# Altium project SensorNode.PrjPcb
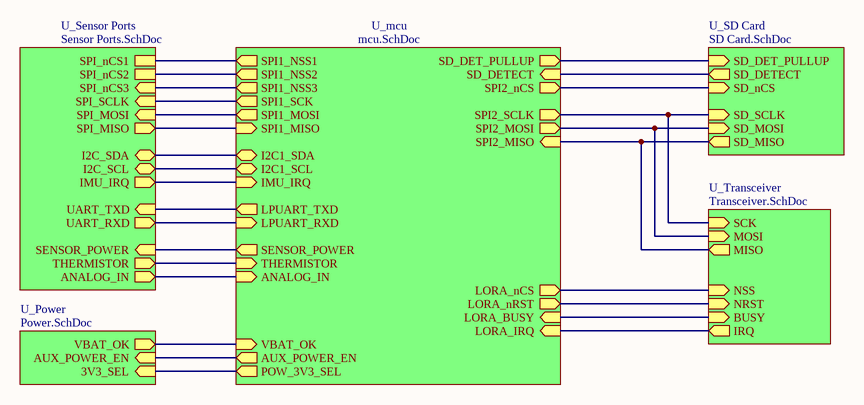
[diagram p0: SensorNode.SchDoc]
6 sheets, 83 parts. Net scope: hierarchical (ports join the sheet entries above them; power ports are global).
Board file: SensorNode.PcbDoc
Sheets:
  SensorNode.SchDoc
    U_mcu = mcu.SchDoc
    U_Sensor Ports = Sensor Ports.SchDoc
    U_SD Card = SD Card.SchDoc
    U_Transceiver = Transceiver.SchDoc
    U_Power = Power.SchDoc

## Sheet SensorNode.SchDoc
size A4

### Sub-sheets
U_mcu = mcu.SchDoc: SPI1_SCK (out), SPI1_MISO (in), SPI1_MOSI (out), I2C1_SDA (bidir), SPI2_MOSI (out), SPI2_MISO (in), SPI2_SCLK (out), SPI2_nCS (out), SD_DET_PULLUP (out), SD_DETECT (in), LORA_nCS (out), LORA_nRST (out), LORA_BUSY (in), LORA_IRQ (in), I2C1_SCL (bidir), AUX_POWER_EN (out), VBAT_OK (in), POW_3V3_SEL (out), LPUART_TXD (out), LPUART_RXD (in), SPI1_NSS1 (out), SPI1_NSS2 (out), SPI1_NSS3 (out), ANALOG_IN (in), THERMISTOR (in), SENSOR_POWER (out), IMU_IRQ (in)
U_Power = Power.SchDoc: VBAT_OK (out), AUX_POWER_EN (in), 3V3_SEL (in)
U_SD Card = SD Card.SchDoc: SD_nCS (in), SD_MOSI (in), SD_SCLK (in), SD_MISO (out), SD_DET_PULLUP (in), SD_DETECT (out)
U_Sensor Ports = Sensor Ports.SchDoc: I2C_SDA (bidir), I2C_SCL (bidir), UART_TXD (in), UART_RXD (out), SPI_MOSI (in), SPI_SCLK (in), SPI_MISO (out), SPI_nCS3 (in), SPI_nCS1, SPI_nCS2, SENSOR_POWER (in), ANALOG_IN (out), THERMISTOR (out), IMU_IRQ (out)
U_Transceiver = Transceiver.SchDoc: SCK (in), NRST (in), BUSY (in), MOSI (in), NSS (in), MISO (out), IRQ (out)

### Nets
I2C_SCL: sheet U_mcu/I2C1_SCL, sheet U_Sensor Ports/I2C_SCL
I2C_SDA: sheet U_mcu/I2C1_SDA, sheet U_Sensor Ports/I2C_SDA
LORA_BUSY: sheet U_mcu/LORA_BUSY, sheet U_Transceiver/BUSY
LORA_IRQ: sheet U_mcu/LORA_IRQ, sheet U_Transceiver/IRQ
LORA_nCS: sheet U_mcu/LORA_nCS, sheet U_Transceiver/NSS
LORA_nRST: sheet U_mcu/LORA_nRST, sheet U_Transceiver/NRST
SD_nCS: sheet U_mcu/SPI2_nCS, sheet U_SD Card/SD_nCS
SPI2_MISO: sheet U_mcu/SPI2_MISO, sheet U_SD Card/SD_MISO, sheet U_Transceiver/MISO
SPI2_MOSI: sheet U_mcu/SPI2_MOSI, sheet U_SD Card/SD_MOSI, sheet U_Transceiver/MOSI
SPI2_SCLK: sheet U_mcu/SPI2_SCLK, sheet U_SD Card/SD_SCLK, sheet U_Transceiver/SCK
NetCD1_10: sheet U_mcu/SD_DETECT, sheet U_SD Card/SD_DETECT
NetP1_1: sheet U_mcu/ANALOG_IN, sheet U_Sensor Ports/ANALOG_IN
NetP8_2: sheet U_mcu/LPUART_TXD, sheet U_Sensor Ports/UART_TXD
NetP8_3: sheet U_mcu/LPUART_RXD, sheet U_Sensor Ports/UART_RXD
NetP9_1: sheet U_mcu/SPI1_NSS1, sheet U_Sensor Ports/SPI_nCS1
NetP9_2: sheet U_mcu/SPI1_NSS2, sheet U_Sensor Ports/SPI_nCS2
NetP9_3: sheet U_mcu/SPI1_NSS3, sheet U_Sensor Ports/SPI_nCS3
NetP9_4: sheet U_mcu/SPI1_SCK, sheet U_Sensor Ports/SPI_SCLK
NetP9_5: sheet U_mcu/SPI1_MOSI, sheet U_Sensor Ports/SPI_MOSI
NetP9_6: sheet U_mcu/SPI1_MISO, sheet U_Sensor Ports/SPI_MISO
NetR6_2: sheet U_mcu/POW_3V3_SEL, sheet U_Power/3V3_SEL
NetR17_1: sheet U_mcu/SD_DET_PULLUP, sheet U_SD Card/SD_DET_PULLUP
NetR20_2: sheet U_mcu/SENSOR_POWER, sheet U_Sensor Ports/SENSOR_POWER
NetR21_1: sheet U_mcu/THERMISTOR, sheet U_Sensor Ports/THERMISTOR
NetU1_39: sheet U_mcu/AUX_POWER_EN, sheet U_Power/AUX_POWER_EN
NetU1_40: sheet U_mcu/VBAT_OK, sheet U_Power/VBAT_OK
NetU1_46: sheet U_mcu/IMU_IRQ, sheet U_Sensor Ports/IMU_IRQ

## Sheet mcu.SchDoc
size A4
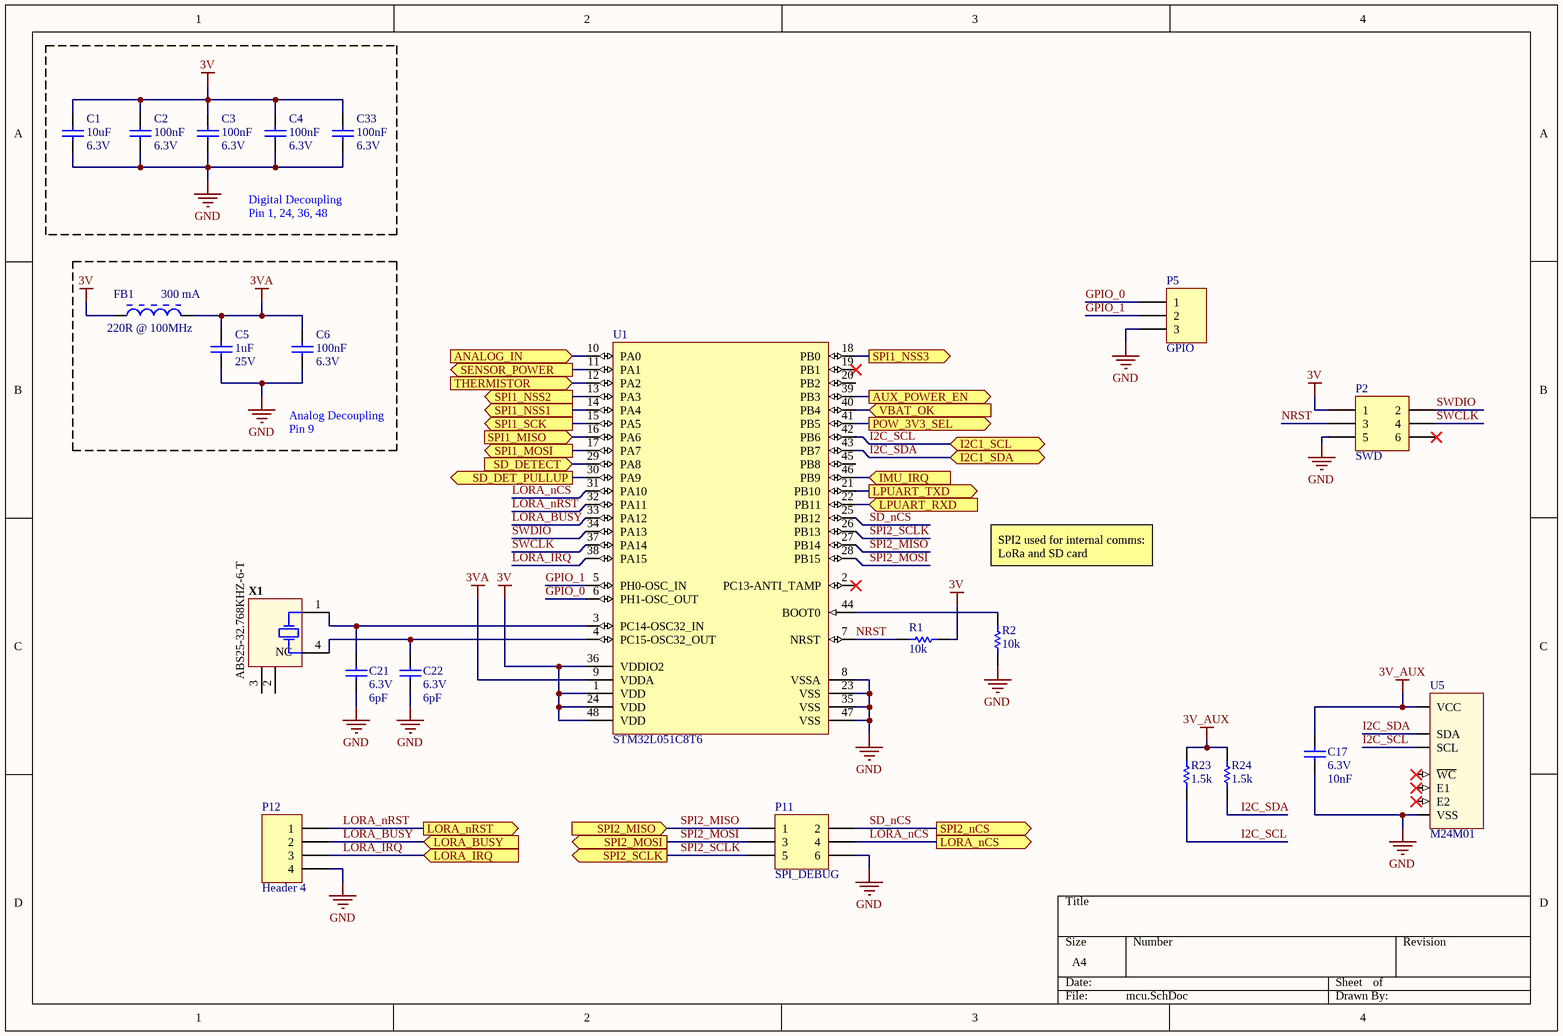
[diagram p1: mcu.SchDoc]

### Parts
C1  value 10uF  Voltage: 6.3V  [0603 (1608M)]  (hidden comment: Cap)
C2  value 100nF  Voltage: 6.3V  [0603 (1608M)]  (hidden comment: Cap)
C3  value 100nF  Voltage: 6.3V  [0603 (1608M)]  (hidden comment: Cap)
C4  value 100nF  Voltage: 6.3V  [0603 (1608M)]  (hidden comment: Cap)
C5  value 1uF  Voltage: 25V  [0603 (1608M)]  (hidden comment: Cap)
C6  value 100nF  Voltage: 6.3V  [0603 (1608M)]  (hidden comment: Cap)
C17  value 10nF  Voltage: 6.3V  [0603 (1608M)]  (hidden comment: Cap)
C21  value 6pF  Voltage: 6.3V  [0603 (1608M)]  (hidden comment: Cap)
C22  value 6pF  Voltage: 6.3V  [0603 (1608M)]  (hidden comment: Cap)
C33  value 100nF  Voltage: 6.3V  [0603 (1608M)]  (hidden comment: Cap)
FB1  Rated Current: 300 mA  Parameter 1: 220R @ 100MHz  [MURA-BLM15-CHIP-2_V]  (hidden comment: BLM15GG221SN1D)
P2  SWD  [HDR2X3]
P5  GPIO  [HDR1X3]
P11  SPI_DEBUG  [HDR2X3]
P12  Header 4  [HDR1X4]
R1  value 10k  [0603 (1608M)]  (hidden comment: Resistor)
R2  value 10k  [0603 (1608M)]  (hidden comment: Resistor)
R23  value 1.5k  [0603 (1608M)]  (hidden comment: Resistor)
R24  value 1.5k  [0603 (1608M)]  (hidden comment: Resistor)
U1  STM32L051C8T6  [STM-LQFP48_L]
U5  M24M01  [TSSOP-8]
X1  ABS25-32.768KHZ-6-T  [ABRA-ABS25-4_V]

### Ports
ANALOG_IN (in), AUX_POWER_EN (out), I2C1_SCL (bidir), I2C1_SDA (bidir), IMU_IRQ (in), LORA_BUSY (in), LORA_IRQ (in), LORA_nCS (out), LORA_nRST (out), LPUART_RXD (in), LPUART_TXD (out), POW_3V3_SEL (out), SD_DET_PULLUP (out), SD_DETECT (in), SENSOR_POWER (out), SPI1_MISO (in), SPI1_MOSI (out), SPI1_NSS1 (out), SPI1_NSS2 (out), SPI1_NSS3 (out), SPI1_SCK (out), SPI2_MISO (in), SPI2_MOSI (out), SPI2_nCS (out), SPI2_SCLK (out), THERMISTOR (in), VBAT_OK (in)

### Nets
3V: C1.2 C2.2 C3.2 C4.2 C33.2 FB1.2 P2.1 R1.1 U1.1(VDD) U1.24(VDD) U1.36(VDDIO2) U1.48(VDD)
3V_AUX: C17.2 R23.2 R24.2 U5.8(VCC)
3VA: C5.2 C6.2 FB1.1 U1.9(VDDA)
GND: C1.1 C2.1 C3.1 C4.1 C5.1 C6.1 C17.1 C21.1 C22.1 C33.1 P2.5 P5.3 P11.6 P12.4 R2.1 U1.8(VSSA) U1.23(VSS) U1.35(VSS) U1.47(VSS) U5.4(VSS)
GPIO_0: P5.1 U1.6(PH1-OSC_OUT)
GPIO_1: P5.2 U1.5(PH0-OSC_IN)
I2C_SCL: R23.1 U1.42(PB6) U5.6(SCL) ; port I2C1_SCL
I2C_SDA: R24.1 U1.43(PB7) U5.5(SDA) ; port I2C1_SDA
LORA_BUSY: P12.2 U1.33(PA12) ; port LORA_BUSY
LORA_IRQ: P12.3 U1.38(PA15) ; port LORA_IRQ
LORA_nCS: P11.4 U1.31(PA10) ; port LORA_nCS
LORA_nRST: P12.1 U1.32(PA11) ; port LORA_nRST
NRST: P2.3 R1.2 U1.7(NRST)
SD_nCS: P11.2 U1.25(PB12) ; port SPI2_nCS
SPI2_MISO: P11.1 U1.27(PB14) ; port SPI2_MISO
SPI2_MOSI: P11.3 U1.28(PB15) ; port SPI2_MOSI
SPI2_SCLK: P11.5 U1.26(PB13) ; port SPI2_SCLK
SWCLK: P2.4 U1.37(PA14)
SWDIO: P2.2 U1.34(PA13)
NetC21_2: C21.2 U1.3(PC14-OSC32_IN) X1.1(X1)
NetC22_2: C22.2 U1.4(PC15-OSC32_OUT) X1.4(X2)
NetCD1_10: U1.29(PA8) ; port SD_DETECT
NetP1_1: U1.10(PA0) ; port ANALOG_IN
NetP8_2: U1.21(PB10) ; port LPUART_TXD
NetP8_3: U1.22(PB11) ; port LPUART_RXD
NetP9_1: U1.14(PA4) ; port SPI1_NSS1
NetP9_2: U1.13(PA3) ; port SPI1_NSS2
NetP9_3: U1.18(PB0) ; port SPI1_NSS3
NetP9_4: U1.15(PA5) ; port SPI1_SCK
NetP9_5: U1.17(PA7) ; port SPI1_MOSI
NetP9_6: U1.16(PA6) ; port SPI1_MISO
NetR2_2: R2.2 U1.44(BOOT0)
NetR6_2: U1.41(PB5) ; port POW_3V3_SEL
NetR17_1: U1.30(PA9) ; port SD_DET_PULLUP
NetR20_2: U1.11(PA1) ; port SENSOR_POWER
NetR21_1: U1.12(PA2) ; port THERMISTOR
NetU1_39: U1.39(PB3) ; port AUX_POWER_EN
NetU1_40: U1.40(PB4) ; port VBAT_OK
NetU1_46: U1.46(PB9) ; port IMU_IRQ

Not connected (* = marked no-connect by the designer): P2 6*; U1 2(PC13-ANTI_TAMP)* 19(PB1)* 20(PB2) 45(PB8); U5 2(E1)* 3(E2)* 7(~{WC})*; X1 2(NC) 3(NC)

### Notes on the sheet
- Digital Decoupling
- Pin 1, 24, 36, 48
- Analog Decoupling
- Pin 9
- SPI2 used for internal comms:
  LoRa and SD card

### Library data of the parts
C1-C6 C17 C21 C22 C33 = Cap: Capacitor
FB1 = CMP-0686-00164-3: Chip Ferrite Bead for High-GHz Band General Use, 220 Ohm, 300 mA, -55 to 125 degC, 1 x 0.5 x 0.55 mm SMD, Tape and Reel; Manufacturer: Murata; DC Resistance: 0.7 Ohm Max.; Impedance (at 100 MHz): 220 Ohm +/- 25%; PackageDescription: 2-Pin Chip, Body 1 x 0.5 mm; PartNumber: BLM15GG221SN1D; PackageReference: BLM15-2; ComponentLink3URL: http://www.murata.com/products/catalog/pdf/c31e.pdf; ComponentLink2URL: http://www.murata.com/products/catalog/pdf/c31e.pdf; ComponentLink2Description: Datasheet; Operating Temperature Range: -55 to 125 degC; ComponentLink1Description: Manufacturer URL; ComponentLink3Description: Package Specification; DatasheetVersion: 08/2013; ComponentLink1URL: http://www.murata.com/; Mounting Technology: Surface Mount; Packing: Tape and Reel
P2 P11 = Header 3X2: Header, 3-Pin, Dual row; LatestRevisionDate: 17-Jul-2002; LatestRevisionNote: Re-released for DXP Platform.; Publisher: Altium Limited
P5 = Header 3: Header, 3-Pin; LatestRevisionDate: 17-Jul-2002; LatestRevisionNote: Re-released for DXP Platform.; Publisher: Altium Limited
P12 = Header 4: Header, 4-Pin; LatestRevisionDate: 17-Jul-2002; LatestRevisionNote: Re-released for DXP Platform.; Publisher: Altium Limited
R1 R2 R23 R24 = Resistor: Tolerance: 5%; Published: 8-Jun-2000; LatestRevisionDate: 17-Jul-2002; LatestRevisionNote: Re-released for DXP Platform.; PackageReference: AXIAL-0.3; Publisher: Altium Limited; PackageDescription: Axial Device, Thru-Hole; 2 Leads; 0.3 in Pin Spacing
U1 = CMP-1546-00003-1: Ultra-Low-Power ARM Cortex-M0+ MCU, 64 KB Flash, 1.8 to 3.6 V, -40 to 85 degC, 48-Pin LQFP, RoHS, Tray; RAM: 8 KB; Flash: 64 KB; Data EEPROM: 2 KB; VDD Max: 3.6 V; VDD Min: 1.8 V; PartNumber: STM32L051C8T6; ComponentLink3URL: http://www.st.com/st-web-ui/static/active/en/resource/technical/document/datasheet/DM00058181.pdf; ComponentLink1URL: http://www.st.com/web/en/home.html; Temperature Min: -40 degC; DatasheetVersion: Rev. 4; ComponentLink3Description: Package Specification; Mounting Technology: Surface Mount; ComponentLink1Description: Manufacturer URL; Packing: Tray; Temperature Max: 85 degC; ComponentLink2URL: http://www.st.com/st-web-ui/static/active/en/resource/technical/document/datasheet/DM00108219.pdf; PackageDescription: 48-Pin Frame Chip Scale Package, Body 7 x 7 mm, Pitch 0.5 mm; ComponentLink2Description: Datasheet; RoHS: TRUE
U5 = M24M01: EEPROM Memory IC 1Mb (128K x 8) I²C 1MHz 500ns 8-TSSOP
X1 = CMP-2000-05036-1: Low Frequency Crystal, 32.768 KHz, 6 pF, +/- 20 ppm, -40 to 85 degC, 4-Pin SMD, RoHS, Tape and Reel; Manufacturer: Abracon; Tolerance: 20PPM; ESR: 50kOhms; Case Width: 3.8mm; Case Height: 2.5mm; Case Length: 8mm; Load Capacitance: 6pF; Operating Temperature Range: -40Cto+85C; Package Reference: ABS25; Factory Pack Quantity: 3000; Package Description: 4-Pin Surface Mount Device, Body 8 x 3.8 mm, Pitch 5.5 mm; Frequency: 32.768kHz; Termination Style: SMD/SMT; Manufacturer URL: http://www.abracon.com/; Type: LowFrequencyCrystal; Dimensions: 3.8mmWx8mmLx2.5mmH; Product Category: Crystals; Series: ABS25; RoHS: Details; Package / Case: 8mmx3.8mm; Datasheet Version: Jun-17; Brand: ABRACON; Datasheet URL: https://datasheet.ciiva.com/854/abs25-854528.pdf; Packaging: Reel; Mounting Style: SMD/SMT

## Sheet Sensor Ports.SchDoc
size A4
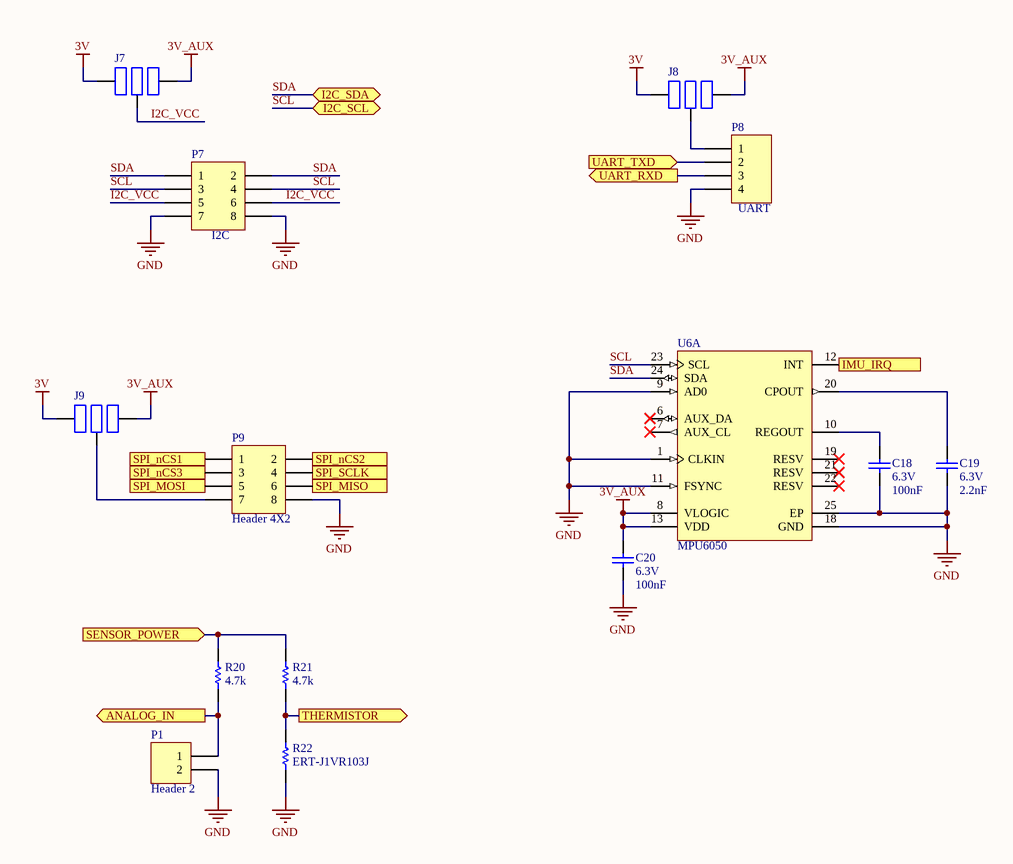
[diagram p2: Sensor Ports.SchDoc]

### Parts
C18  value 100nF  Voltage: 6.3V  [0603 (1608M)]  (hidden comment: Cap)
C19  value 2.2nF  Voltage: 6.3V  [0603 (1608M)]  (hidden comment: Cap)
C20  value 100nF  Voltage: 6.3V  [0603 (1608M)]  (hidden comment: Cap)
J7  3 Way Open Jumper  [Jumper-3 (Open)]  (value not drawn)  (no BOM)
J8  3 Way Open Jumper  [Jumper-3 (Open)]  (value not drawn)  (no BOM)
J9  3 Way Open Jumper  [Jumper-3 (Open)]  (value not drawn)  (no BOM)
P1  Header 2  [HDR1X2]
P7  I2C  [HDR2X4]
P8  UART  [HDR1X4]
P9  Header 4X2  [HDR2X4]
R20  value 4.7k  [0603 (1608M)]  (hidden comment: Resistor)
R21  value 4.7k  [0603 (1608M)]  (hidden comment: Resistor)
R22  ERT-J1VR103J  [RESC1608X90X30ML15T20]
U6  MPU6050  [INSE-QFN-24_V]  (part A of 2)

### Ports
ANALOG_IN (out), I2C_SCL (bidir), I2C_SDA (bidir), IMU_IRQ (out), SENSOR_POWER (in), SPI_MISO (out), SPI_MOSI (in), SPI_nCS1, SPI_nCS2, SPI_nCS3 (in), SPI_SCLK (in), THERMISTOR (out), UART_RXD (out), UART_TXD (in)

### Nets
3V: J7.1 J8.1 J9.1
3V_AUX: C20.2 J7.3 J8.3 J9.3 U6.8(VLOGIC) U6.13(VDD)
GND: C18.1 C19.1 C20.1 P1.2 P7.7 P7.8 P8.4 P9.8 R22.1 U6.1(CLKIN) U6.9(AD0) U6.11(FSYNC) U6.18(GND) U6.25(EP)
I2C_VCC: J7.2 P7.5 P7.6
SCL: P7.3 P7.4 U6.23(SCL) ; port I2C_SCL  [project net I2C_SCL]
SDA: P7.1 P7.2 U6.24(SDA) ; port I2C_SDA  [project net I2C_SDA]
NetC18_2: C18.2 U6.10(REGOUT)
NetC19_2: C19.2 U6.20(CPOUT)
NetJ8_2: J8.2 P8.1
NetJ9_2: J9.2 P9.7
NetP1_1: P1.1 R20.1 ; port ANALOG_IN
NetP8_2: P8.2 ; port UART_TXD
NetP8_3: P8.3 ; port UART_RXD
NetP9_1: P9.1 ; port SPI_nCS1
NetP9_2: P9.2 ; port SPI_nCS2
NetP9_3: P9.3 ; port SPI_nCS3
NetP9_4: P9.4 ; port SPI_SCLK
NetP9_5: P9.5 ; port SPI_MOSI
NetP9_6: P9.6 ; port SPI_MISO
NetR20_2: R20.2 R21.2 ; port SENSOR_POWER
NetR21_1: R21.1 R22.2 ; port THERMISTOR
NetU1_46: U6.12(INT) ; port IMU_IRQ

Not connected (* = marked no-connect by the designer): U6 6(AUX_DA)* 7(AUX_CL)* 19(RESV)* 21(RESV)* 22(RESV)*

### Library data of the parts
C18-C20 = Cap: Capacitor
J7-J9 = Jumper-3 (Open)
P1 = Header 2: Header, 2-Pin; LatestRevisionDate: 17-Jul-2002; LatestRevisionNote: Re-released for DXP Platform.; Publisher: Altium Limited
P7 P9 = Header 4X2: Header, 4-Pin, Dual row; LatestRevisionDate: 17-Jul-2002; LatestRevisionNote: Re-released for DXP Platform.; Publisher: Altium Limited
P8 = Header 4: Header, 4-Pin; LatestRevisionDate: 17-Jul-2002; LatestRevisionNote: Re-released for DXP Platform.; Publisher: Altium Limited
R20 R21 = Resistor: Tolerance: 5%; Published: 8-Jun-2000; LatestRevisionDate: 17-Jul-2002; LatestRevisionNote: Re-released for DXP Platform.; PackageReference: AXIAL-0.3; Publisher: Altium Limited; PackageDescription: Axial Device, Thru-Hole; 2 Leads; 0.3 in Pin Spacing
R22 = CMP-2000-00869-1: Manufacturer: Panasonic; Part Number: ERT-J1VR103J
U6 = CMP-1753-00002-1: 3-Axis Gyroscope, 3-Axis Accelerometer / , 2.375 to 3.46 V, -40 to 105 degC, 24-Pin QFN, RoHS, Tape and Reel; Resistance: 5.6 kohm; Tolerance: 1%; Voltage Rating: 75 V; Power Rating: 100 mW; ComponentLink1Description: Manufacturer URL; Mount: Surface Mount; Max Operating Temperature: 155degC; Package Quantity: 5000; ComponentLink2Description: Datasheet; Pins: 2; Packaging: Tape and Reel; Case Code (Imperial): 0603; PackageReference: QFN-24; ComponentLink2URL: https://datasheet.ciiva.com/1513/1788002-1513632.pdf; Radiation Hardening: No; ComponentLink1URL: http://www.invensense.com/; PackageDescription: 24-Pin Quad Flat No-lead Package, Body 4 x 4 mm, Pitch 0.5 mm; Height: 0.45 mm; Case/Package: 0603; Case Code (Metric): 1608; REACH SVHC: Yes; Min Operating Temperature: -55degC; DatasheetVersion: Rev. 3.4, 08/2013; Width: 0.8 mm; RoHSCompliant: True; Length: 1.6 mm

## Sheet SD Card.SchDoc
size A4
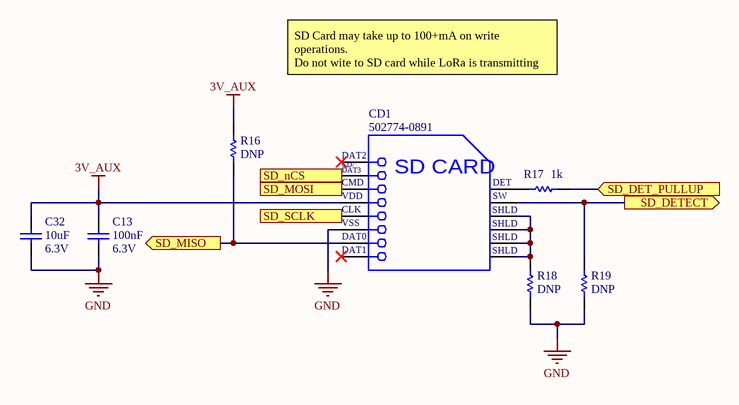
[diagram p3: SD Card.SchDoc]

### Parts
C13  value 100nF  Voltage: 6.3V  [0603 (1608M)]  (hidden comment: Cap)
C32  value 10uF  Voltage: 6.3V  [0603 (1608M)]  (hidden comment: Cap)
CD1  502774-0891  [MOLX-502774-0891_V]
R16  value DNP  [0603 (1608M)]  (hidden comment: Resistor)
R17  value 1k  [0603 (1608M)]  (hidden comment: Resistor)
R18  value DNP  [0603 (1608M)]  (hidden comment: Resistor)
R19  value DNP  [0603 (1608M)]  (hidden comment: Resistor)

### Ports
SD_DET_PULLUP (in), SD_DETECT (out), SD_MISO (out), SD_MOSI (in), SD_nCS (in), SD_SCLK (in)

### Nets
3V_AUX: C13.2 C32.2 CD1.4(VDD) R16.2
GND: C13.1 C32.1 CD1.6(VSS) R18.1 R19.1
SD_nCS: CD1.2(CD/DAT3) ; port SD_nCS
SPI2_MISO: CD1.7(DAT0) R16.1 ; port SD_MISO
SPI2_MOSI: CD1.3(CMD) ; port SD_MOSI
SPI2_SCLK: CD1.5(CLK) ; port SD_SCLK
NetCD1_9: CD1.9(DETECT) R17.2
NetCD1_10: CD1.10(SWITCH) R19.2 ; port SD_DETECT
NetCD1_11: CD1.11(SHLD) CD1.12(SHLD) CD1.13(SHLD) CD1.14(SHLD) R18.2
NetR17_1: R17.1 ; port SD_DET_PULLUP

Not connected (* = marked no-connect by the designer): CD1 1(DAT2)* 8(DAT1)*

### Notes on the sheet
- SD Card may take up to 100+mA on write operations.
  Do not wite to SD card while LoRa is transmitting
- (in symbol CMP-2000-05248-1) CD/; DAT3; SD CARD; DET; SW

### Library data of the parts
C13 C32 = Cap: Capacitor
CD1 = CMP-2000-05248-1: Micro SD Memory Card Connector, 0.5 A, 10 V (DC), -25 to 85 degC, 8-Pin SMT, RoHS, Tape and Reel; Manufacturer: Molex; 3D Model: 502774-0891.stp; Online Catalog: microSD™Series; Number of Positions: 10(8+2); Card Type: SecureDigital-microSD™; Insertion, Removal Method: PushIn,PushOut; Other Names: WM24066DKR; Connector Type: ConnectorandEjector; Features: Switch; Family: MemoryConnectors-PCCardSockets; Manufacturer URL: http://www.molex.com/; Mounting Type: SurfaceMount,RightAngle; Contact Finish Thickness: 20µin(0.51µm); Standard Package: 1; Series: 502774; Ejector Side: -; Datasheet Version: Rev. D, 04/2004; Category: Connectors,Interconnects; Contact Finish: Gold; Datasheet URL: https://datasheet.ciiva.com/1104/1499551-1104671.pdf; RoHS Information: 502774-0891CertofCompliance; Mounting Feature: Reverse-Bottom; Packaging: Digi-Reel; Height Above Board: 0.071"(1.80mm); Catalog Drawings: 502774-0891
R16-R19 = Resistor: Tolerance: 5%; Published: 8-Jun-2000; LatestRevisionDate: 17-Jul-2002; LatestRevisionNote: Re-released for DXP Platform.; PackageReference: AXIAL-0.3; Publisher: Altium Limited; PackageDescription: Axial Device, Thru-Hole; 2 Leads; 0.3 in Pin Spacing

## Sheet Transceiver.SchDoc
size A4
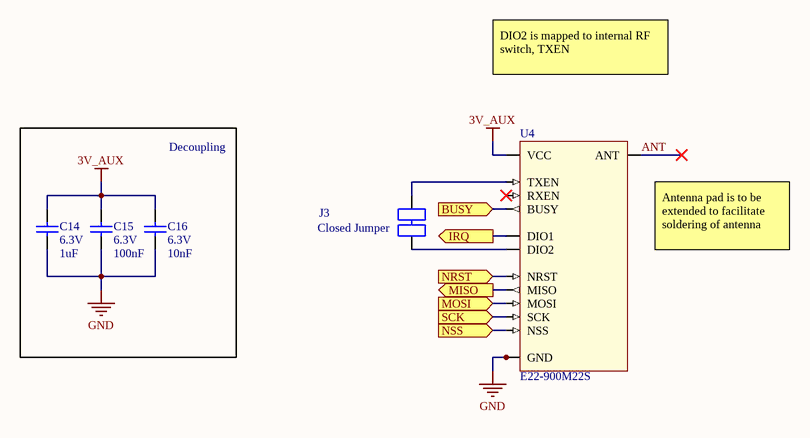
[diagram p4: Transceiver.SchDoc]

### Parts
C14  value 1uF  Voltage: 6.3V  [0603 (1608M)]  (hidden comment: Cap)
C15  value 100nF  Voltage: 6.3V  [0603 (1608M)]  (hidden comment: Cap)
C16  value 10nF  Voltage: 6.3V  [0603 (1608M)]  (hidden comment: Cap)
J3  Closed Jumper  [Jumper (Close)]  (net tie, no BOM)
U4  E22-900M22S  [E22-900M22S]

### Blocks framed on the sheet
Decoupling: C14-C16

### Ports
BUSY (in), IRQ (out), MISO (out), MOSI (in), NRST (in), NSS (in), SCK (in)

### Nets
3V_AUX: C14.2 C15.2 C16.2 U4.9(VCC)
GND: C14.1 C15.1 C16.1 U4.1(GND) U4.2(GND) U4.3(GND) U4.4(GND) U4.5(GND) U4.10(GND) U4.11(GND) U4.12(GND) U4.20(GND) U4.22(GND)
ANT: U4.21(ANT)
LORA_BUSY: U4.14(BUSY) ; port BUSY
LORA_IRQ: U4.13(DIO1) ; port IRQ
LORA_nCS: U4.19(NSS) ; port NSS
LORA_nRST: U4.15(NRST) ; port NRST
SPI2_MISO: U4.16(MISO) ; port MISO
SPI2_MOSI: U4.17(MOSI) ; port MOSI
SPI2_SCLK: U4.18(SCK) ; port SCK
NetJ3_1: J3.1 U4.8(DIO2)
NetJ3_2: J3.2 U4.7(TXEN)

Not connected (* = marked no-connect by the designer): U4 6(RXEN)*

### Notes on the sheet
- DIO2 is mapped to internal RF switch, TXEN
- (near U4) Antenna pad is to be extended to facilitate soldering of antenna

### Library data of the parts
C14-C16 = Cap: Capacitor
J3 = Jumper (Closed)
U4 = E22-900M22S: SX1262-based Wireless Module; ComponentLink1Description: Product Page; ComponentLink1URL: http://www.ebyte.com/en/product-view-news.aspx?id=437

## Sheet Power.SchDoc
size A4
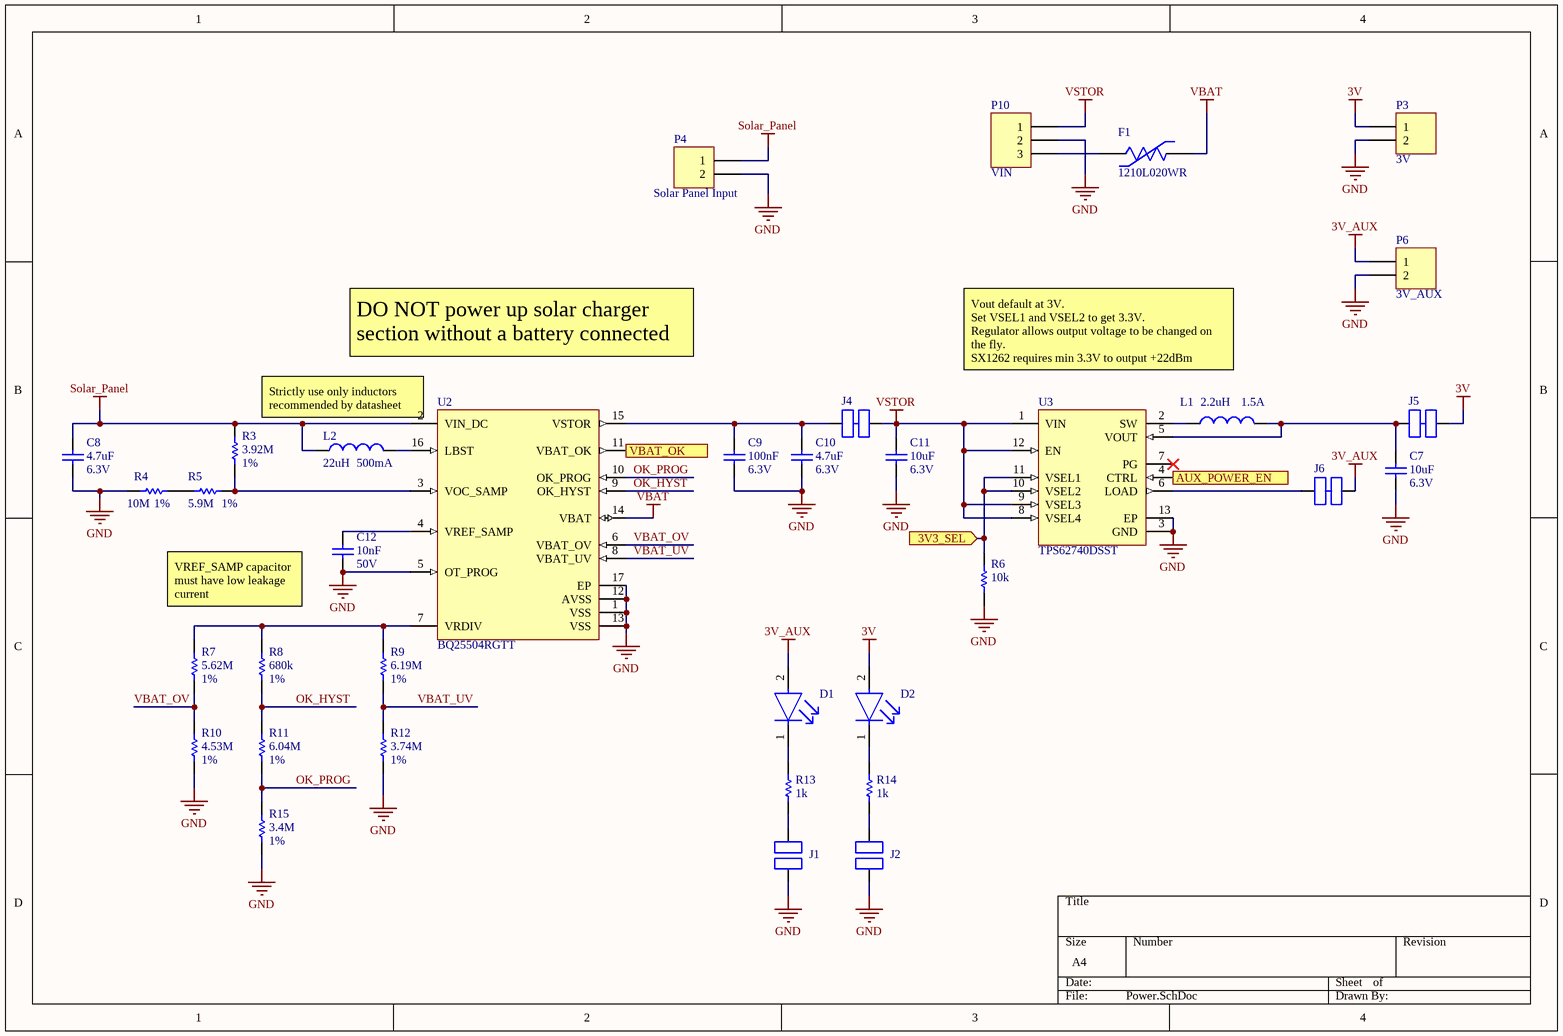
[diagram p5: Power.SchDoc]

### Parts
C7  value 10uF  Voltage: 6.3V  [0603 (1608M)]  (hidden comment: Cap)
C8  value 4.7uF  Voltage: 6.3V  [0603 (1608M)]  (hidden comment: Cap)
C9  value 100nF  Voltage: 6.3V  [0603 (1608M)]  (hidden comment: Cap)
C10  value 4.7uF  Voltage: 6.3V  [0603 (1608M)]  (hidden comment: Cap)
C11  value 10uF  Voltage: 6.3V  [0603 (1608M)]  (hidden comment: Cap)
C12  value 10nF  Voltage: 50V  [0603 (1608M)]  (hidden comment: Cap)
D1  SML-D12P8WT86  [FP-SML-D12-MFG]  (value not drawn)
D2  SML-D12P8WT86  [FP-SML-D12-MFG]  (value not drawn)
F1  1210L020WR  [FP-1210L-MFG]
J1  Open Jumper  [Jumper (Open)]  (value not drawn)  (no BOM)
J2  Open Jumper  [Jumper (Open)]  (value not drawn)  (no BOM)
J4  Closed Jumper  [Jumper (Close)]  (value not drawn)  (net tie, no BOM)
J5  Closed Jumper  [Jumper (Close)]  (value not drawn)  (net tie, no BOM)
J6  Closed Jumper  [Jumper (Close)]  (value not drawn)  (net tie, no BOM)
L1  Parameter 1: 2.2uH  Parameter 2: 1.5A  [SMD-1008]  (hidden comment: 74479787222)
L2  Inductance: 22uH  Current: 500mA  [WE-TPC 2828]  (hidden comment: 744025220)
P3  3V  [HDR1X2]
P4  Solar Panel Input  [HDR1X2]
P6  3V_AUX  [HDR1X2]
P10  VIN  [HDR1X3]
R3  value 3.92M  Tolerance: 1%  [0603 (1608M)]  (hidden comment: Resistor)
R4  value 10M  Tolerance: 1%  [0603 (1608M)]  (hidden comment: Resistor)
R5  value 5.9M  Tolerance: 1%  [0603 (1608M)]  (hidden comment: Resistor)
R6  value 10k  [0603 (1608M)]  (hidden comment: Resistor)
R7  value 5.62M  Tolerance: 1%  [0603 (1608M)]  (hidden comment: Resistor)
R8  value 680k  Tolerance: 1%  [0603 (1608M)]  (hidden comment: Resistor)
R9  value 6.19M  Tolerance: 1%  [0603 (1608M)]  (hidden comment: Resistor)
R10  value 4.53M  Tolerance: 1%  [0603 (1608M)]  (hidden comment: Resistor)
R11  value 6.04M  Tolerance: 1%  [0603 (1608M)]  (hidden comment: Resistor)
R12  value 3.74M  Tolerance: 1%  [0603 (1608M)]  (hidden comment: Resistor)
R13  value 1k  [0603 (1608M)]  (hidden comment: Resistor)
R14  value 1k  [0603 (1608M)]  (hidden comment: Resistor)
R15  value 3.4M  Tolerance: 1%  [0603 (1608M)]  (hidden comment: Resistor)
U2  BQ25504RGTT  [RGT0016C_V]
U3  TPS62740DSST  [DSS0012A_V]

### Ports
3V3_SEL (in), AUX_POWER_EN (in), VBAT_OK (out)

### Nets
3V: D2.2(A) J5.2 P3.1
3V_AUX: D1.2(A) J6.2 P6.1
GND: C7.1 C8.1 C9.1 C10.1 C11.1 C12.1 J1.1 J2.1 P3.2 P4.2 P6.2 P10.2 R4.1 R6.1 R10.1 R12.1 R15.1 U2.1(VSS) U2.5(OT_PROG) U2.12(AVSS) U2.13(VSS) U2.17(EP) U3.3(GND) U3.13(EP)
Solar_Panel: C8.2 L2.1 P4.1 R3.2 U2.2(VIN_DC)
VBAT: F1.2 U2.14(VBAT)
VSTOR: C11.2 J4.2 P10.1 U3.1(VIN) U3.8(VSEL4) U3.9(VSEL3) U3.12(EN)
OK_HYST: R8.1 R11.2 U2.9(OK_HYST)
OK_PROG: R11.1 R15.2 U2.10(OK_PROG)
VBAT_OV: R7.1 R10.2 U2.6(VBAT_OV)
VBAT_UV: R9.1 R12.2 U2.8(VBAT_UV)
NetC7_2: C7.2 J5.1 L1.2 U3.5(VOUT)
NetC9_2: C9.2 C10.2 J4.1 U2.15(VSTOR)
NetC12_2: C12.2 U2.4(VREF_SAMP)
NetD1_1: D1.1(C) R13.2
NetD2_1: D2.1(C) R14.2
NetF1_1: F1.1 P10.3
NetJ1_2: J1.2 R13.1
NetJ2_2: J2.2 R14.1
NetJ6_1: J6.1 U3.6(LOAD)
NetL1_1: L1.1 U3.2(SW)
NetL2_2: L2.2 U2.16(LBST)
NetR3_1: R3.1 R5.2 U2.3(VOC_SAMP)
NetR4_2: R4.2 R5.1
NetR6_2: R6.2 U3.10(VSEL2) U3.11(VSEL1) ; port 3V3_SEL
NetR7_2: R7.2 R8.2 R9.2 U2.7(VRDIV)
NetU1_39: U3.4(CTRL) ; port AUX_POWER_EN
NetU1_40: U2.11(VBAT_OK) ; port VBAT_OK

Not connected (* = marked no-connect by the designer): U3 7(PG)*

### Notes on the sheet
- DO NOT power up solar charger section without a battery connected
- Vout default at 3V.
  Set VSEL1 and VSEL2 to get 3.3V.
  Regulator allows output voltage to be changed on the fly.
  SX1262 requires min 3.3V to output +22dBm
- (near U2) Strictly use only inductors recommended by datasheet
- VREF_SAMP capacitor must have low leakage current

### Library data of the parts
C7-C12 = Cap: Capacitor
D1 D2 = CMP-08952-000019-1: LED GREEN DIFFUSED 0603 SMD; Manufacturer: Rohm; Forward Current: 20mA; Luminous Intensity: 6.3mcd; Led Orientation: Top View; Forward Voltage: 2.2V; Power Dissipation: 54mW; Reverse Voltage: 5V; Wavelength: 560nm; Colour: Green; Temperature Range Low: -40°C; ComponentLink2URL: https://d1d2qsbl8m0m72.cloudfront.net/en/products/databook/datasheet/opto/led/chip_mono/sml-d12x8_d13x8-e.pdf; Category: Diode; Device Class L2: LEDs; Package: SML-D12; Digikey Description: LED GREEN DIFFUSED 0603 SMD; Mouser Description: SML-D12 Series Green 0603 Diffused 6.3 mcd 2.2 V Surface Mount LED; RoHS: TRUE; Temperature Range High: +85°C; Octopart: https://octopart.com/sml-d12p8wt86-rohm-9289138; Height: 0.65mm; Lead Free: Yes; Device Class L1: Optoelectronics; ComponentLink2Description: Datasheet; Manufacturer Part Number: SML-D12P8WT86; Temperature: -40°C to +85°C; Device Class L3: unset; Automotive: No
F1 = CMP-08606-000032-1: PTC RESET FUSE 30V 200MA 1210; Manufacturer: Littelfuse; Resistance: 0.8-5Ω; Hold Current: 0.2A; Trip Time: 0.02s; Value: 0.8-5Ω; Description: PTC Resettable Fuse 0.2A(hold) 0.4A(trip) 30VDC 10A 0.6W 0.02s 0.8Ohm SMD Solder Pad 1210 T/R; Trip Current: 0.4A; Current Rating: 10A; Device Class L3: unset; Voltage Rating: 30V; Mouser Description: PTC Resettable Fuse 0.2A(hold) 0.4A(trip) 30VDC 10A 0.6W 0.02s 0.8Ohm SMD Solder Pad 1210 T/R; RoHS: TRUE; Height: 1mm; Manufacturer Part Number: 1210L020WR; Digikey Description: PTC RESET FUSE 30V 200MA 1210; Device Class L1: Circuit Protection; Temperature Range High: +85°C; Temperature: -40°C to +85°C; Temperature Range Low: -40°C; Lead Free: Yes; Automotive: No; Package: 1210L; ComponentLink2URL: https://m.littelfuse.com/~/media/electronics/datasheets/resettable_ptcs/littelfuse_ptc_1210l_datasheet.pdf.pdf; Ambient Temperature Range High: +85°C; Device Class L2: PTC Resettable Fuses; Octopart: https://octopart.com/1210l020wr-littelfuse-673644; Ambient Temperature Range Low: -40°C; Category: Fuse; ComponentLink2Description: Datasheet
J1 J2 = Jumper (Open)
J4-J6 = Jumper (Closed)
L1 = CMP-1392-00018-1: Power Multilayer Inductor WE-PMI, L=2.20 µH; Manufacturer: Wuerth Elektronik; Inductance: 2.20 ÂµH; PackageReference: SMD-1008; ComponentLink1Description: Manufacturer URL; ComponentLink1URL: http://www.we-online.com; ComponentLink2URL: http://www.we-online.de/katalog/media/pdf/74479787222A.pdf; ComponentLink2Description: Datasheet; PartNumber: 74479787222
L2 = CMP-1479-00015-1: SMD Shielded Tiny Power Inductor WE-TPC, L=22.0 µH /; Manufacturer: Wuerth Elektronik; Inductance: 22.0 ÂµH; PackageReference: WE-TPC 2828; ComponentLink2URL: http://www.we-online.de/katalog/media/pdf/744025220.pdf; ComponentLink1Description: Manufacturer URL; PartNumber: 744025220; ComponentLink1URL: http://www.we-online.com; ComponentLink2Description: Datasheet
P3 P6 = Header 2: Header, 2-Pin; LatestRevisionDate: 17-Jul-2002; LatestRevisionNote: Re-released for DXP Platform.; Publisher: Altium Limited
P4 = Header 2: LatestRevisionDate: 17-Jul-2002; LatestRevisionNote: Re-released for DXP Platform.; Publisher: Altium Limited
P10 = Header 3: Header, 3-Pin; LatestRevisionDate: 17-Jul-2002; LatestRevisionNote: Re-released for DXP Platform.; Publisher: Altium Limited
R6 R13 R14 = Resistor: Tolerance: 5%; Published: 8-Jun-2000; LatestRevisionDate: 17-Jul-2002; LatestRevisionNote: Re-released for DXP Platform.; PackageReference: AXIAL-0.3; Publisher: Altium Limited; PackageDescription: Axial Device, Thru-Hole; 2 Leads; 0.3 in Pin Spacing
U2 = CMP-0321-00258-2: Ultra Low Power Boost Converter with Battery Management for Energy Harvester App, 0.13 V, -40 to 85 degC, 16-pin QFN (RGT), Green (RoHS & no Sb/Br); Manufacturer: Texas Instruments; Li-Ion: N; SubFamily: Battery Charge Management; Vin(Min)(V): 0.13; ComponentLink1URL: http://www.ti.com/general/docs/lit/getliterature.tsp?genericPartNumber=BQ25504&fileType=pdf; ComponentLink1Description: Datasheet; PartNumber: BQ25504RGTT; DatasheetVersion: SLUSAH0; PackageVersion: revH, Oct-2011; Lead Acid: N; PackageDescription: 16-Pin Plastic Quad Flat No-Lead, 3 x 3 mm Body, 0.5 mm Pitch, 1.7 x 1.7 mm Exposed Pad; Mounting Technology: Surface Mount; Eco-Plan: Green (RoHS & no Sb/Br); NiMH: N; PackageReference: RGT0016C; Over Voltage Protection: N; Li-Polymer: N; NiCd: N; Code_JEDEC: MO-220
U3 = CMP-0323-00573-2: Step Down Converter For Low Power Applications, 2.2 to 5.5 V VIN, -40 to 85 degC, 12-Pin WSON (DSS), RoHS, Tape and Reel; VIN Min: 2.2 V; VOUT Max: 3.3 V; VOUT Min: 1.8 V; VIN Max: 5.5 V; PackageVersion: 4209244/C, 07/2011; ComponentLink1URL: http://www.ti.com/; Packing: Tape and Reel; PartNumber: TPS62740; ComponentLink2URL: http://www.ti.com/lit/ds/symlink/tps62740.pdf; RoHS: TRUE; ComponentLink3Description: Package Specification; Temperature Min: -40 degC; ComponentLink1Description: Manufacturer URL; PackageReference: DSS0012A; ComponentLink2Description: Datasheet; DatasheetVersion: SLVSB02B; Temperature Max: 85 degC; ComponentLink3URL: http://www.ti.com/litv/pdf/mpds336b; PackageDescription: 12-Pin Plastic Small Outline, Body 3 x 2 mm, Pitch 0.5 mm; Mounting Technology: Surface Mount
R3-R5 R7-R12 R15 = Resistor: Published: 8-Jun-2000; LatestRevisionDate: 17-Jul-2002; LatestRevisionNote: Re-released for DXP Platform.; PackageReference: AXIAL-0.3; Publisher: Altium Limited; PackageDescription: Axial Device, Thru-Hole; 2 Leads; 0.3 in Pin Spacing

## Nets that join several sheets
3V: mcu (12 pins), Sensor Ports (J7.1 J8.1 J9.1), Power (D2.2 J5.2 P3.1)
3V_AUX: mcu (C17.2 R23.2 R24.2 U5.8), Sensor Ports (6 pins), SD Card (C13.2 C32.2 CD1.4 R16.2), Transceiver (C14.2 C15.2 C16.2 U4.9), Power (D1.2 J6.2 P6.1)
GND: mcu (20 pins), Sensor Ports (14 pins), SD Card (5 pins), Transceiver (13 pins), Power (24 pins)
I2C_SCL: mcu (R23.1 U1.42 U5.6), Sensor Ports (P7.3 P7.4 U6.23)
I2C_SDA: mcu (R24.1 U1.43 U5.5), Sensor Ports (P7.1 P7.2 U6.24)
LORA_BUSY: mcu (P12.2 U1.33), Transceiver (U4.14)
LORA_IRQ: mcu (P12.3 U1.38), Transceiver (U4.13)
LORA_nCS: mcu (P11.4 U1.31), Transceiver (U4.19)
LORA_nRST: mcu (P12.1 U1.32), Transceiver (U4.15)
NetCD1_10: mcu (U1.29), SD Card (CD1.10 R19.2)
NetP1_1: mcu (U1.10), Sensor Ports (P1.1 R20.1)
NetP8_2: mcu (U1.21), Sensor Ports (P8.2)
NetP8_3: mcu (U1.22), Sensor Ports (P8.3)
NetP9_1: mcu (U1.14), Sensor Ports (P9.1)
NetP9_2: mcu (U1.13), Sensor Ports (P9.2)
NetP9_3: mcu (U1.18), Sensor Ports (P9.3)
NetP9_4: mcu (U1.15), Sensor Ports (P9.4)
NetP9_5: mcu (U1.17), Sensor Ports (P9.5)
NetP9_6: mcu (U1.16), Sensor Ports (P9.6)
NetR6_2: mcu (U1.41), Power (R6.2 U3.10 U3.11)
NetR17_1: mcu (U1.30), SD Card (R17.1)
NetR20_2: mcu (U1.11), Sensor Ports (R20.2 R21.2)
NetR21_1: mcu (U1.12), Sensor Ports (R21.1 R22.2)
NetU1_39: mcu (U1.39), Power (U3.4)
NetU1_40: mcu (U1.40), Power (U2.11)
NetU1_46: mcu (U1.46), Sensor Ports (U6.12)
SD_nCS: mcu (P11.2 U1.25), SD Card (CD1.2)
SPI2_MISO: mcu (P11.1 U1.27), SD Card (CD1.7 R16.1), Transceiver (U4.16)
SPI2_MOSI: mcu (P11.3 U1.28), SD Card (CD1.3), Transceiver (U4.17)
SPI2_SCLK: mcu (P11.5 U1.26), SD Card (CD1.5), Transceiver (U4.18)